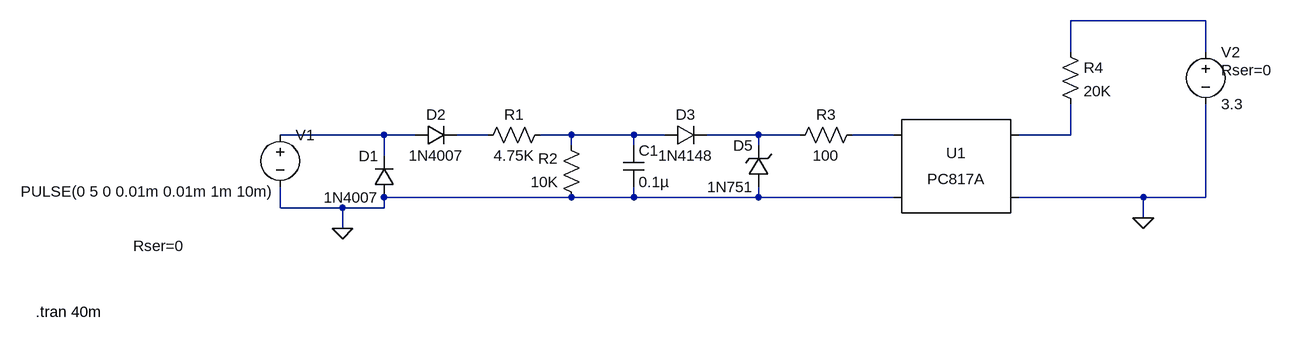
[diagram p0: schematic RPM_probe_simulation.asc]
RPM_probe_simulation.asc, the LTspice schematic file:
Version 4
SHEET 1 1440 680
WIRE 1328 -80 1120 -80
WIRE 1120 -32 1120 -80
WIRE 1328 -32 1328 -80
WIRE 64 96 -96 96
WIRE 112 96 64 96
WIRE 224 96 176 96
WIRE 352 96 304 96
WIRE 448 96 352 96
WIRE 496 96 448 96
WIRE 640 96 560 96
WIRE 704 96 640 96
WIRE 848 96 784 96
WIRE 1120 96 1120 48
WIRE 1120 96 1040 96
WIRE 352 112 352 96
WIRE 448 112 448 96
WIRE 640 112 640 96
WIRE 64 128 64 96
WIRE 352 192 64 192
WIRE 448 192 448 176
WIRE 448 192 352 192
WIRE 640 192 640 176
WIRE 640 192 448 192
WIRE 848 192 640 192
WIRE 1232 192 1040 192
WIRE 1328 192 1328 48
WIRE 1328 192 1232 192
WIRE -96 208 -96 176
WIRE 0 208 -96 208
WIRE 64 208 64 192
WIRE 64 208 0 208
WIRE 1232 224 1232 192
WIRE 0 240 0 208
FLAG 0 240 0
FLAG 1232 224 0
SYMBOL diode 80 192 R180
WINDOW 0 24 64 Left 2
WINDOW 3 24 0 Left 2
SYMATTR InstName D1
SYMATTR Value 1N4007
SYMBOL diode 112 112 R270
WINDOW 0 32 32 VTop 2
WINDOW 3 0 32 VBottom 2
SYMATTR InstName D2
SYMATTR Value 1N4007
SYMBOL diode 496 112 R270
WINDOW 0 32 32 VTop 2
WINDOW 3 0 32 VBottom 2
SYMATTR InstName D3
SYMATTR Value 1N4148
SYMBOL res 320 80 R90
WINDOW 0 0 56 VBottom 2
WINDOW 3 32 56 VTop 2
SYMATTR InstName R1
SYMATTR Value 4.75K
SYMATTR SpiceLine tol=1 pwr=0.1
SYMBOL res 368 208 R180
WINDOW 0 36 76 Left 2
WINDOW 3 36 40 Left 2
SYMATTR InstName R2
SYMATTR Value 10K
SYMATTR SpiceLine tol=1 pwr=0.1
SYMBOL cap 432 112 R0
SYMATTR InstName C1
SYMATTR Value 0.1µ
SYMATTR SpiceLine V=16 Irms=3.85 Rser=0.0464862 Lser=0
SYMBOL res 800 80 R90
WINDOW 0 0 56 VBottom 2
WINDOW 3 32 56 VTop 2
SYMATTR InstName R3
SYMATTR Value 100
SYMATTR SpiceLine tol=1 pwr=0.1
SYMBOL Optos\\PC817A 944 144 R0
SYMATTR InstName U1
SYMBOL zener 656 176 R180
WINDOW 0 24 64 Left 2
WINDOW 3 24 0 Left 2
SYMATTR InstName D5
SYMATTR Value 1N751
SYMBOL voltage -96 80 R0
WINDOW 123 0 0 Left 0
WINDOW 39 -226 187 Left 2
WINDOW 3 -399 103 Left 2
SYMATTR SpiceLine Rser=0
SYMATTR Value PULSE(0 5 0 0.01m 0.01m 1m 10m)
SYMATTR InstName V1
SYMBOL voltage 1328 -48 R0
WINDOW 123 0 0 Left 0
WINDOW 39 24 44 Left 2
SYMATTR SpiceLine Rser=0
SYMATTR InstName V2
SYMATTR Value 3.3
SYMBOL res 1104 -48 R0
SYMATTR InstName R4
SYMATTR Value 20K
SYMATTR SpiceLine tol=1 pwr=0.1
TEXT -472 368 Left 2 !.tran 40m

The netlist it stands for:
* RPM_probe_simulation.asc
D1 0 N002 1N4007
D2 N002 N003 1N4007
D3 N004 N005 1N4148
R1 N004 N003 4.75K tol=1 pwr=0.1
R2 0 N004 10K tol=1 pwr=0.1
C1 N004 0 0.1µ V=16 Irms=3.85 Rser=0.0464862 Lser=0
R3 N006 N005 100 tol=1 pwr=0.1
XU1 N006 0 N007 0 PC817 Igain=1m
D5 0 N005 1N751
V1 N002 0 PULSE(0 5 0 0.01m 0.01m 1m 10m) Rser=0
V2 N001 0 3.3 Rser=0
R4 N001 N007 20K tol=1 pwr=0.1
.model D D
.lib standard.dio
.tran 40m
.lib PC817.sub
.backanno
.end